# EAGLE schematic BatteryModule (EAGLE 8.1.0)
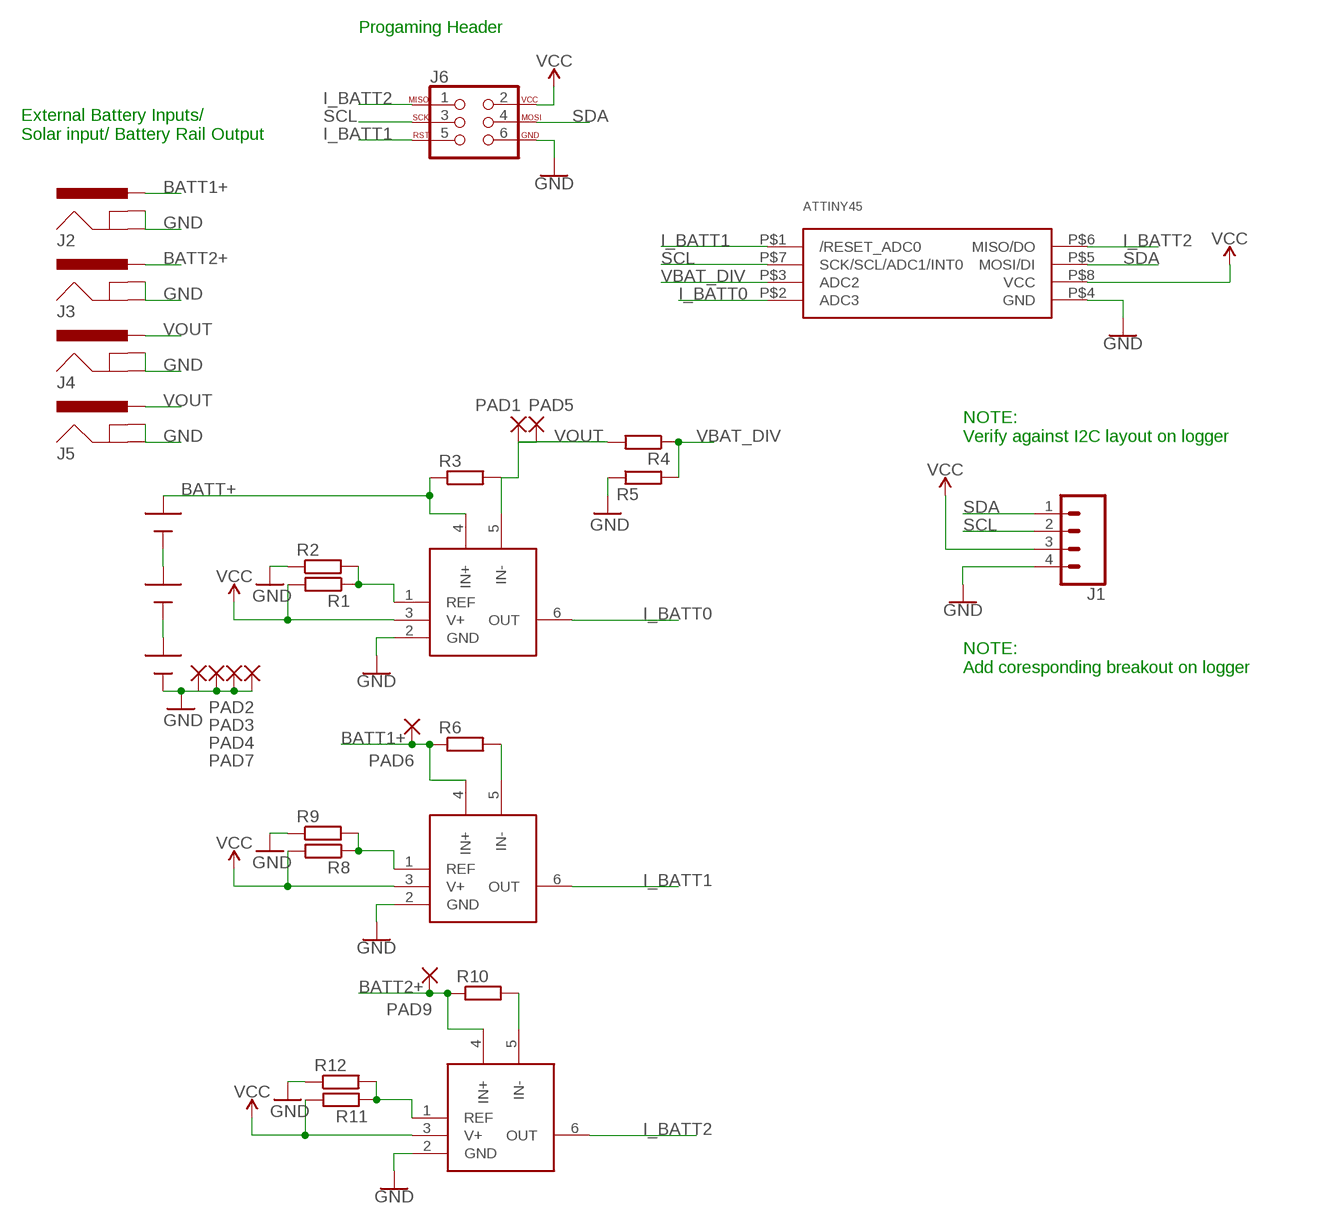
[diagram p0: schematic, sheet 1]

## Parts
J1  CONN_04  [1X04]
J2  5.5x2.1mm Barrel  POWER_JACKSMD  [POWER_JACK_SMD]
J3  5.5x2.1mm Barrel  POWER_JACKSMD  [POWER_JACK_SMD]
J4  5.5x2.1mm Barrel  POWER_JACKSMD  [POWER_JACK_SMD]
J5  5.5x2.1mm Barrel  POWER_JACKSMD  [POWER_JACK_SMD]
J6  AVR_SPI_PROG_3X2PTH  [2X3]
PAD1  2,15/1,0  [2,15/1,0]
PAD2  2,15/1,0  [2,15/1,0]
PAD3  2,15/1,0  [2,15/1,0]
PAD4  2,15/1,0  [2,15/1,0]
PAD5  2,15/1,0  [2,15/1,0]
PAD6  2,15/1,0  [2,15/1,0]
PAD7  2,15/1,0  [2,15/1,0]
PAD9  2,15/1,0  [2,15/1,0]
R1  R-EU_R0603  [R0603]
R2  R-EU_R0603  [R0603]
R3  R-EU_R0805  [R0805]
R4  R-EU_R0603  [R0603]
R5  R-EU_R0603  [R0603]
R6  R-EU_R0805  [R0805]
R8  R-EU_R0603  [R0603]
R9  R-EU_R0603  [R0603]
R10  R-EU_R0805  [R0805]
R11  R-EU_R0603  [R0603]
R12  R-EU_R0603  [R0603]
U$1  18650  [BATT_18650_CLIP]
U$2  18650  [BATT_18650_CLIP]
U$3  18650  [BATT_18650_CLIP]
U$4  ATTINY45  [SOIC8]
U$5  INA212  [TSOT23-6_DDC]
U$6  INA212  [TSOT23-6_DDC]
U$8  INA212  [TSOT23-6_DDC]

## Nets
BATT1+: J2.VIN0(PWR) PAD6.1(P) R6.1 U$6.4(IN+)
BATT2+: J3.VIN0(PWR) PAD9.1(P) R10.1 U$8.4(IN+)
BATT+: R3.1 U$3.BATT+@1(BATT+) U$5.4(IN+)
GND: J1.4 J2.GND(GNDBREAK) J2.P$4(GND) J3.GND(GNDBREAK) J3.P$4(GND) J4.GND(GNDBREAK) J4.P$4(GND) J5.GND(GNDBREAK) J5.P$4(GND) J6.6 PAD2.1(P) PAD3.1(P) PAD4.1(P) PAD7.1(P) R2.1 R5.1 R9.1 R12.1 U$1.BATT-@1(BATT-) U$4.P$4(GND) U$5.2(GND) U$8.2(GND)
I_BATT0: U$4.P$2(ADC3) U$5.6(OUT)
I_BATT1: J6.5 U$4.P$1(/RESET_ADC0) U$6.6(OUT)
I_BATT2: J6.1 U$4.P$6(MISO/DO) U$8.6(OUT)
N$1: U$1.BATT+@1(BATT+) U$2.BATT-@1(BATT-)
N$2: U$2.BATT+@1(BATT+) U$3.BATT-@1(BATT-)
N$3: R8.1 R9.2 U$6.1(REF)
N$4: R6.2 U$6.5(IN-)
N$5: R10.2 U$8.5(IN-)
N$6: R11.1 R12.2 U$8.1(REF)
N$7: R1.1 R2.2 U$5.1(REF)
SCL: J1.2 J6.3 U$4.P$7(SCK/SCL/ADC1/INT0)
SDA: J1.1 J6.4 U$4.P$5(MOSI/DI)
VBAT_DIV: R4.1 R5.2 U$4.P$3(ADC2)
VCC: J1.3 J6.2 R1.2 R8.2 R11.2 U$4.P$8(VCC) U$5.3(V+) U$8.3(V+)
VOUT: J4.VIN0(PWR) J5.VIN0(PWR) PAD1.1(P) PAD5.1(P) R3.2 R4.2 U$5.5(IN-)
Unconnected: U$6.2(GND) U$6.3(V+)

## Notes on the sheet
- Progaming Header
- External Battery Inputs/
  Solar input/ Battery Rail Output
- NOTE:
  Verify against I2C layout on logger
- NOTE:
  Add coresponding breakout on logger

## Library data of the parts
J1 = SparkFun-Connectors:CONN_04: Multi connection point. Often used as Generic Header-pin footprint for 0.1 inch spaced/style header connections On any of the 0.1 inch spaced packages, you can populate with these: Break Away Headers - Straight <https://www.sparkfun.com/products/116> (PRT-00116) Break Away Male Headers - Right Angle <https://www.sparkfun.com/products/553> (PRT-00553) Female Headers <https://www.sparkfun.com/products/115> (PRT-00115) Break Away Headers - Machine Pin <https://www.sparkfun.com/products/117> (PRT-00117) Break Away Female Headers - Swiss Machine Pin <https://www.sparkfun.com/products/743> (PRT-00743) For SCREWTERMINALS and SPRING TERMINALS visit here: Screw Terimnals on SparkFun.com <https://www.sparkfun.com/search/results?term=Screw+Terminals> (5mm/3.5mm/2.54mm spacing) This device is also useful as a general connection point to wire up your design to another part of your project. Our various solder wires solder well into these plated through hole pads. Hook-Up Wire - Assortment (Stranded, 22 AWG) <https://www.sparkfun.com/products/11375> (PRT-11375) Hook-Up Wire - Assortment (Solid Core, 22 AWG) <https://www.sparkfun.com/products/11367> (PRT-11367) View the entire wire category on our website here <https://www.sparkfun.com/categories/141> Special notes: Molex polarized connector foot print use with SKU : PRT-08231 with associated crimp pins and housings. 1MM SMD Version SKU: PRT-10208; PROD_ID: CONN-09696
J2-J5 = SparkFun-Connectors:POWER_JACK: Power Jack Connector This is the standard 5.5mm barrel jack for power. The PTH is the most common, proven, reliable, footprint. The Slot footprint only works if the mill layer is transmitted to the PCB fab house so be warned. Here are the connectors we sell at SparkFun: DC Barrel Power Jack/Connector <https://www.sparkfun.com/products/119> (PRT-00119) DC Barrel Power Jack/Connector (SMD) <https://www.sparkfun.com/products/12748> (PRT-12748) DC Barrel Jack Adapter - Breadboard Compatible <https://www.sparkfun.com/products/10811> (PRT-10811) It is used on this SparkFun product (and many, many others): SparkFun RedBoard - Programmed with Arduino <https://www.sparkfun.com/products/12757> (DEV-12757) Also, if you need a mating power supply or connector, please check these out: Wall Adapter Power Supply - 9VDC 650mA <https://www.sparkfun.com/products/298> (TOL-00298) DC Barrel Jack Adapter - Male <https://www.sparkfun.com/products/10287> (PRT-10287); PROD_ID: CONN-08106; SF_ID: PRT-12748
J6 = SparkFun-Connectors:AVR_SPI_PROG_3X2: AVR ISP 6 Pin This is the reduced ISP connector for AVR programming. Common on Arduino. This footprint will take up less PCB space and can be used with a 10-pin to 6-pin adapter such as SKU: BOB-08508 **Special note about "TEST_POINT" package. The stop mask is on the top side, so if you want your programming test points to be on the bottom of your board, make sure to place this package on the bottom side of the board. This also ensure that the orientation to program from the bottom side will be correct. SparkFun Products: SparkFun ISP Pogo Adapter <https://www.sparkfun.com/products/11591> - NS Tiny AVR Programmer <https://www.sparkfun.com/products/11801> -PTH
PAD1-PAD7 PAD9 = wirepad:2,15/1,0: THROUGH-HOLE PAD
R1-R6 R8-R12 = rcl:R-EU_: RESISTOR, European symbol
U$1-U$3 = Custom:18650
U$4 = SparkFun-IC-Microcontroller:ATTINY45
U$5 U$6 U$8 = texas:INA212